# Altium schematic sheet PowerSupply.SchDoc
size A4; SheetNumber: 2; SheetTotal: 2
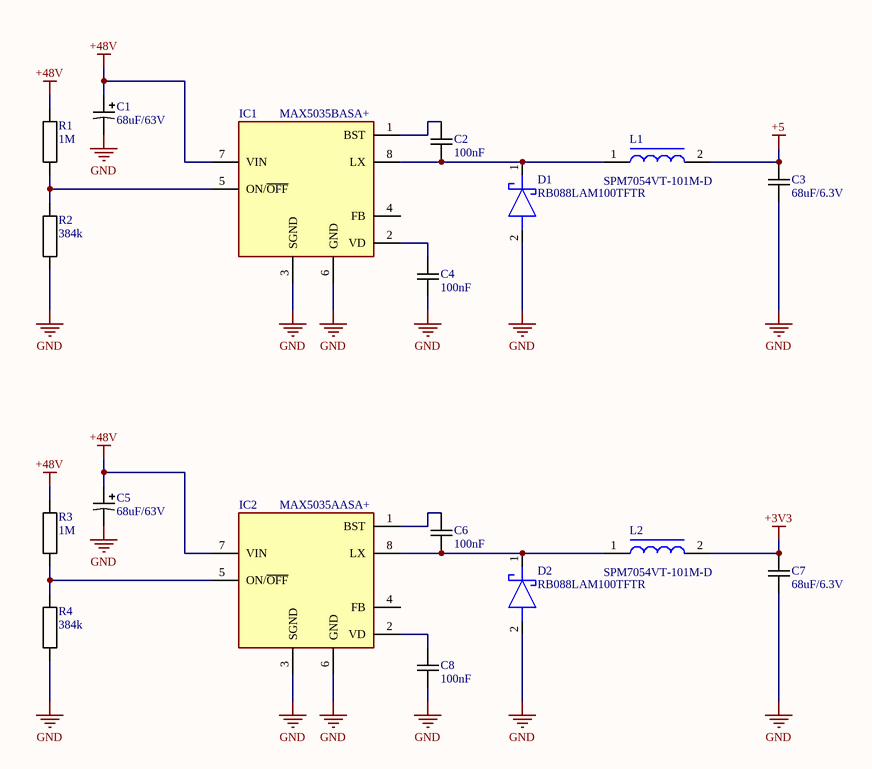
[diagram p0: PowerSupply.SchDoc]

## Parts
C1  68uF/63V  [Capacitor POL SMD D10.0 H10.0]
C2  100nF  [CAPACITOR 1608 REFLOW]
C3  68uF/6.3V  [CAPACITOR 2012 REFLOW]
C4  100nF  [CAPACITOR 1608 REFLOW]
C5  68uF/63V  [Capacitor POL SMD D10.0 H10.0]
C6  100nF  [CAPACITOR 1608 REFLOW]
C7  68uF/6.3V  [CAPACITOR 2012 REFLOW]
C8  100nF  [CAPACITOR 1608 REFLOW]
D1  RB088LAM100TFTR  [SODFL4725X105N]
D2  RB088LAM100TFTR  [SODFL4725X105N]
IC1  MAX5035BASA+  [SOIC127P600X175-8N]
IC2  MAX5035AASA+  [SOIC127P600X175-8N]
L1  SPM7054VT-101M-D  [SPM7054VT]
L2  SPM7054VT-101M-D  [SPM7054VT]
R1  1M  [RESISTOR 1608 REFLOW]
R2  384k  [RESISTOR 1608 REFLOW]
R3  1M  [RESISTOR 1608 REFLOW]
R4  384k  [RESISTOR 1608 REFLOW]

## Nets
+3V3: C7.2 L2.2
+5: C3.2 L1.2
+48V: C1.1 C5.1 IC1.7(VIN) IC2.7(VIN) R1.2 R3.2
GND: C1.2 C3.1 C4.2 C5.2 C7.1 C8.2 D1.2(A) D2.2(A) IC1.3(SGND) IC1.6(GND) IC2.3(SGND) IC2.6(GND) R2.1 R4.1
NetC2_1: C2.1 IC1.1(BST)
NetC2_2: C2.2 D1.1(K) IC1.8(LX) L1.1
NetC4_1: C4.1 IC1.2(VD)
NetC6_1: C6.1 IC2.1(BST)
NetC6_2: C6.2 D2.1(K) IC2.8(LX) L2.1
NetC8_1: C8.1 IC2.2(VD)
NetIC1_5: IC1.5(ON/~{OFF}) R1.1 R2.2
NetIC2_5: IC2.5(ON/~{OFF}) R3.1 R4.2

Not connected (* = marked no-connect by the designer): IC1 4(FB); IC2 4(FB)

## Library data of the parts
C1 C5 = Capacitor Polarized: Value: 68uF/63V
C2-C4 C6-C8 = Capacitor
  C2 C4 C6 C8: Value: 100nF
  C3 C7: Value: 68uF/6.3V
D1 D2 = RB088LAM100TFTR: Schottky Diode; Manufacturer_Name: ROHM Semiconductor; Datasheet Link: https://datasheet.datasheetarchive.com/originals/distributors/DKDS-39/8680.pdf; Height: 1.05mm; Manufacturer_Part_Number: RB088LAM100TFTR; Mouser Part Number: 755-RB088LAM100TFTR; Mouser Price/Stock: https://www.mouser.co.uk/ProductDetail/ROHM-Semiconductor/RB088LAM100TFTR?qs=F5EMLAvA7IBXK%2Ft6O%252B6mTA%3D%3D
IC1 IC2 = MAX5035BASA+: Integrated Circuit; Manufacturer_Name: Maxim Integrated; Datasheet Link: http://datasheets.maximintegrated.com/en/ds/MAX5035.pdf; Height: 1.75mm; Manufacturer_Part_Number: MAX5035BASA+; Mouser Part Number: 700-MAX5035BASA; Mouser Price/Stock: https://www.mouser.co.uk/ProductDetail/Maxim-Integrated/MAX5035BASA%2b?qs=1THa7WoU59FgpJhZAGMb5g%3D%3D
L1 L2 = SPM7054VT-101M-D: Inductor (FeSi Core); Manufacturer_Name: TDK; Datasheet Link: https://product.tdk.com/system/files/dam/doc/product/inductor/inductor/smd/catalog/inductor_automotive_power_spm7054vt-d_en.pdf; Manufacturer_Part_Number: SPM7054VT-101M-D; Mouser Part Number: 810-SPM7054VT-101M-D; Mouser Price/Stock: https://www.mouser.co.uk/ProductDetail/TDK/SPM7054VT-101M-D/?qs=byeeYqUIh0MPh4h9VcxBVA%3D%3D; Arrow Part Number: SPM7054VT-101M-D; Arrow Price/Stock: https://www.arrow.com/en/products/spm7054vt-101m-d/tdk
R1-R4 = Resistor
  R1 R3: Value: 1M
  R2 R4: Value: 384k